# Altium schematic sheet PLL.SchDoc
size B; SheetNumber: 9; SheetTotal: 9
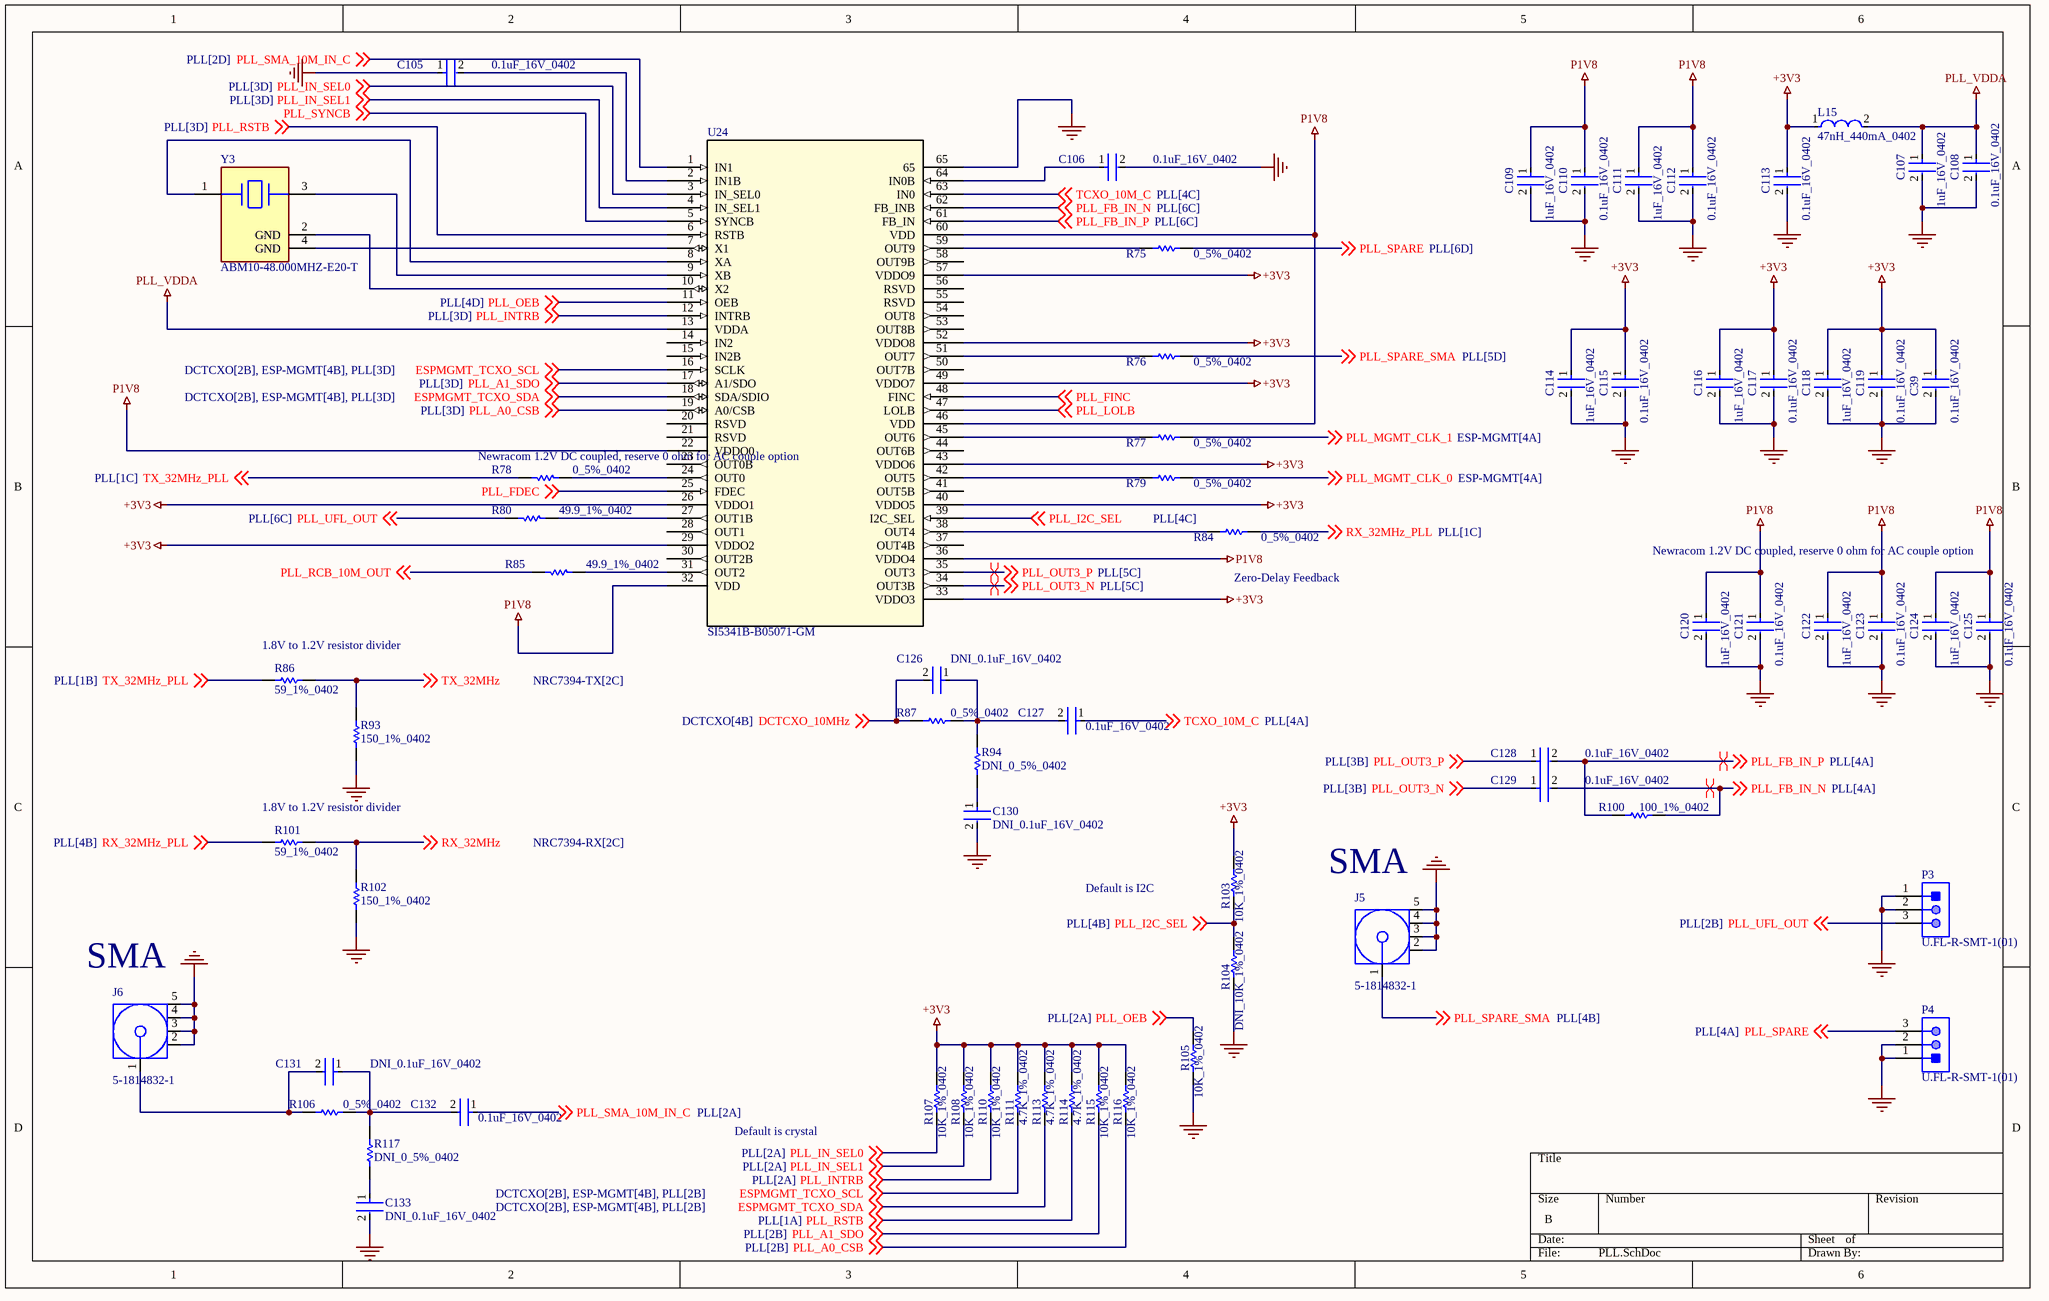
[diagram p0: PLL.SchDoc]

## Parts
C39  0.1uF_16V_0402  [FP-C0402-BB-MFG]
C105  0.1uF_16V_0402  [FP-C0402-BB-MFG]
C106  0.1uF_16V_0402  [FP-C0402-BB-MFG]
C107  1uF_16V_0402  [FP-0402-L_1_0_0_05-W_0_5-IPC_A]
C108  0.1uF_16V_0402  [FP-C0402-BB-MFG]
C109  1uF_16V_0402  [FP-0402-L_1_0_0_05-W_0_5-IPC_A]
C110  0.1uF_16V_0402  [FP-C0402-BB-MFG]
C111  1uF_16V_0402  [FP-0402-L_1_0_0_05-W_0_5-IPC_A]
C112  0.1uF_16V_0402  [FP-C0402-BB-MFG]
C113  0.1uF_16V_0402  [FP-C0402-BB-MFG]
C114  1uF_16V_0402  [FP-0402-L_1_0_0_05-W_0_5-IPC_A]
C115  0.1uF_16V_0402  [FP-C0402-BB-MFG]
C116  1uF_16V_0402  [FP-0402-L_1_0_0_05-W_0_5-IPC_A]
C117  0.1uF_16V_0402  [FP-C0402-BB-MFG]
C118  1uF_16V_0402  [FP-0402-L_1_0_0_05-W_0_5-IPC_A]
C119  0.1uF_16V_0402  [FP-C0402-BB-MFG]
C120  1uF_16V_0402  [FP-0402-L_1_0_0_05-W_0_5-IPC_A]
C121  0.1uF_16V_0402  [FP-C0402-BB-MFG]
C122  1uF_16V_0402  [FP-0402-L_1_0_0_05-W_0_5-IPC_A]
C123  0.1uF_16V_0402  [FP-C0402-BB-MFG]
C124  1uF_16V_0402  [FP-0402-L_1_0_0_05-W_0_5-IPC_A]
C125  0.1uF_16V_0402  [FP-C0402-BB-MFG]
C126  DNI_0.1uF_16V_0402  [FP-C0402-BB-MFG]  (no BOM)
C127  0.1uF_16V_0402  [FP-C0402-BB-MFG]
C128  0.1uF_16V_0402  [FP-C0402-BB-MFG]
C129  0.1uF_16V_0402  [FP-C0402-BB-MFG]
C130  DNI_0.1uF_16V_0402  [FP-C0402-BB-MFG]  (no BOM)
C131  DNI_0.1uF_16V_0402  [FP-C0402-BB-MFG]  (no BOM)
C132  0.1uF_16V_0402  [FP-C0402-BB-MFG]
C133  DNI_0.1uF_16V_0402  [FP-C0402-BB-MFG]  (no BOM)
J5  5-1814832-1  [TECO-5-1814832-1_V]
J6  5-1814832-1  [TECO-5-1814832-1_V]
L15  47nH_440mA_0402  [FP-LQW15AN_80-MFG]
P3  U.FL-R-SMT-1(01)  [HRS-U.FL-R-SMT-3_V]
P4  U.FL-R-SMT-1(01)  [HRS-U.FL-R-SMT-3_V]
R75  0_5%_0402  [RESC1005X40X25NL05T10]
R76  0_5%_0402  [RESC1005X40X25NL05T10]
R77  0_5%_0402  [RESC1005X40X25NL05T10]
R78  0_5%_0402  [RESC1005X40X25NL05T10]
R79  0_5%_0402  [RESC1005X40X25NL05T10]
R80  49.9_1%_0402  [RESC1005X40X25NL10T10]
R84  0_5%_0402  [RESC1005X40X25NL05T10]
R85  49.9_1%_0402  [RESC1005X40X25NL10T10]
R86  59_1%_0402  [RESC1005X40X25LL10T10]
R87  0_5%_0402  [RESC1005X40X25NL05T10]
R93  150_1%_0402  [RESC1005X40X25NL10T10]
R94  DNI_0_5%_0402  [RESC1005X40X25NL05T10]  (no BOM)
R100  100_1%_0402  [RESC1005X40X25NL05T10]
R101  59_1%_0402  [RESC1005X40X25LL10T10]
R102  150_1%_0402  [RESC1005X40X25NL10T10]
R103  10K_1%_0402  [RESC1005X40X25NL10T10]
R104  DNI_10K_1%_0402  [RESC1005X40X25NL10T10]  (no BOM)
R105  10K_1%_0402  [RESC1005X40X25NL10T10]
R106  0_5%_0402  [RESC1005X40X25NL05T10]
R107  10K_1%_0402  [RESC1005X40X25NL10T10]
R108  10K_1%_0402  [RESC1005X40X25NL10T10]
R110  10K_1%_0402  [RESC1005X40X25NL10T10]
R111  4.7K_1%_0402  [RESC1005X40X25NL10T10]
R113  4.7K_1%_0402  [RESC1005X40X25NL10T10]
R114  4.7K_1%_0402  [RESC1005X40X25NL10T10]
R115  10K_1%_0402  [RESC1005X40X25NL10T10]
R116  10K_1%_0402  [RESC1005X40X25NL10T10]
R117  DNI_0_5%_0402  [RESC1005X40X25NL05T10]  (no BOM)
U24  SI5341B-B05071-GM  [QFN64_SI5341_SIL_SKY]
Y3  ABM10-48.000MHZ-E20-T  [FP-ABM10-MFG]

## Nets
+3V3: C39.1 C113.1 C114.1 C115.1 C116.1 C117.1 C118.1 C119.1 L15.1 R103.2 R107.2 R108.2 R110.2 R111.2 R113.2 R114.2 R115.2 R116.2 U24.26(VDDO1) U24.29(VDDO2) U24.33(VDDO3) U24.40(VDDO5) U24.43(VDDO6) U24.49(VDDO7) U24.52(VDDO8) U24.57(VDDO9)
GND: C39.2 C105.1 C106.2 C107.2 C108.2 C109.2 C110.2 C111.2 C112.2 C113.2 C114.2 C115.2 C116.2 C117.2 C118.2 C119.2 C120.2 C121.2 C122.2 C123.2 C124.2 C125.2 C130.2 C133.2 J5.2 J5.3 J5.4 J5.5 J6.2 J6.3 J6.4 J6.5 P3.1 P3.2 P4.1 P4.2 R93.1 R102.1 R104.1 R105.1 U24.65
P1V8: C109.1 C110.1 C111.1 C112.1 C120.1 C121.1 C122.1 C123.1 C124.1 C125.1 U24.22(VDDO0) U24.32(VDD) U24.36(VDDO4) U24.46(VDD) U24.60(VDD)
PLL_VDDA: C107.1 C108.1 L15.2 U24.13(VDDA)
DCTCXO_10MHz: C126.2 R87.1 ; off-sheet DCTCXO_10MHz
ESPMGMT_TCXO_SCL: R111.1 U24.16(SCLK) ; off-sheet ESPMGMT_TCXO_SCL
ESPMGMT_TCXO_SDA: R113.1 U24.18(SDA/SDIO) ; off-sheet ESPMGMT_TCXO_SDA
PLL_A0_CSB: R116.1 U24.19(A0/CSB) ; off-sheet PLL_A0_CSB
PLL_A1_SDO: R115.1 U24.17(A1/SDO) ; off-sheet PLL_A1_SDO
PLL_FB_IN_N: C129.2 R100.2 U24.62(FB_INB) ; off-sheet PLL_FB_IN_N
PLL_FB_IN_P: C128.2 R100.1 U24.61(FB_IN) ; off-sheet PLL_FB_IN_P
PLL_FDEC: U24.25(FDEC) ; off-sheet PLL_FDEC
PLL_FINC: U24.48(FINC) ; off-sheet PLL_FINC
PLL_I2C_SEL: R103.1 R104.2 U24.39(I2C_SEL) ; off-sheet PLL_I2C_SEL
PLL_IN_SEL0: R107.1 U24.3(IN_SEL0) ; off-sheet PLL_IN_SEL0
PLL_IN_SEL1: R108.1 U24.4(IN_SEL1) ; off-sheet PLL_IN_SEL1
PLL_INTRB: R110.1 U24.12(INTRB) ; off-sheet PLL_INTRB
PLL_LOLB: U24.47(LOLB) ; off-sheet PLL_LOLB
PLL_MGMT_CLK_0: R79.2 ; off-sheet PLL_MGMT_CLK_0
PLL_MGMT_CLK_1: R77.2 ; off-sheet PLL_MGMT_CLK_1
PLL_OEB: R105.2 U24.11(OEB) ; off-sheet PLL_OEB
PLL_OUT3_N: C129.1 U24.34(OUT3B) ; off-sheet PLL_OUT3_N
PLL_OUT3_P: C128.1 U24.35(OUT3) ; off-sheet PLL_OUT3_P
PLL_RCB_10M_OUT: R85.1 ; off-sheet PLL_RCB_10M_OUT
PLL_RSTB: R114.1 U24.6(RSTB) ; off-sheet PLL_RSTB
PLL_SMA_10M_IN_C: C132.1 U24.1(IN1) ; off-sheet PLL_SMA_10M_IN_C
PLL_SPARE: P4.3 R75.2 ; off-sheet PLL_SPARE
PLL_SPARE_SMA: J5.1 R76.2 ; off-sheet PLL_SPARE_SMA
PLL_SYNCB: U24.5(SYNCB) ; off-sheet PLL_SYNCB
PLL_UFL_OUT: P3.3 R80.1 ; off-sheet PLL_UFL_OUT
RX_32MHz: R101.2 R102.2 ; off-sheet RX_32MHz
RX_32MHz_PLL: R84.2 R101.1 ; off-sheet RX_32MHz_PLL
TCXO_10M_C: C127.1 U24.63(IN0) ; off-sheet TCXO_10M_C
TX_32MHz: R86.2 R93.2 ; off-sheet TX_32MHz
TX_32MHz_PLL: R78.2 R86.1 ; off-sheet TX_32MHz_PLL
NetC105_2: C105.2 U24.2(IN1B)
NetC106_1: C106.1 U24.64(IN0B)
NetC126_1: C126.1 C127.2 R87.2 R94.2
NetC130_1: C130.1 R94.1
NetC131_1: C131.1 C132.2 R106.2 R117.2
NetC131_2: C131.2 J6.1 R106.1
NetC133_1: C133.1 R117.1
NetR75_1: R75.1 U24.59(OUT9)
NetR76_1: R76.1 U24.51(OUT7)
NetR77_1: R77.1 U24.45(OUT6)
NetR78_1: R78.1 U24.24(OUT0)
NetR79_1: R79.1 U24.42(OUT5)
NetR80_2: R80.2 U24.27(OUT1B)
NetR84_1: R84.1 U24.38(OUT4)
NetR85_2: R85.2 U24.31(OUT2)
NetU24_7: U24.7(X1) Y3.4(GND)
NetU24_8: U24.8(XA) Y3.1
NetU24_9: U24.9(XB) Y3.3
NetU24_10: U24.10(X2) Y3.2(GND)

Not connected (* = marked no-connect by the designer): U24 14(IN2) 15(IN2B) 20(RSVD) 21(RSVD) 23(OUT0B) 28(OUT1) 30(OUT2B) 37(OUT4B) 41(OUT5B) 44(OUT6B) 50(OUT7B) 53(OUT8B) 54(OUT8) 55(RSVD) 56(RSVD) 58(OUT9B)

## Layout directives
differential pair: PLL_FB_IN_N, PLL_FB_IN_P, PLL_OUT3_N, PLL_OUT3_P

## Notes on the sheet
- Newracom 1.2V DC coupled, reserve 0 ohm for AC couple option
- (near R84) Newracom 1.2V DC coupled, reserve 0 ohm for AC couple option
- (near R84) Zero-Delay Feedback
- (near R86) 1.8V to 1.2V resistor divider
- (near R101) 1.8V to 1.2V resistor divider
- Default is I2C
- (near J5) SMA
- (near J6) SMA
- Default is crystal

## Library data of the parts
C39 C105 C106 C108 C110 C112 C113 C115 C117 C119 C121 C123 C125-C133 = CMP-1034-02068-3: CAP CER 0.1UF 16V 5% X7R 0402; Manufacturer: Kemet; Manufacturer Part Number: C0402C104J4RACTU; Value: 0.10 μF; Temperature Coefficient: 15%; Tolerance: 0.05; Material: Ceramic; ComponentLink2URL: https://content.kemet.com/datasheets/KEM_C1002_X7R_SMD.pdf; Automotive: No; Device Class L2: Capacitors; Temperature: -55°C to +125°C; RoHS: TRUE; Voltage Rating: 16 V; ComponentLink2Description: Datasheet; Device Class L3: Ceramic Capacitors; Temperature Range Low: -55°C; Ipc Land Pattern Name: CAPC10050X50; Device Class L1: Passive Components; Temperature Range High: +125°C; Package: C0402-BB; Capacitance: 0.10 μF; Category: Cap; Mouser Description: CAP CER 0.1UF 16V X7R 0402; Height: 0.55mm; Digikey Description: CAP CER 0.1UF 16V 5% X7R 0402; Octopart: https://octopart.com/c0402c104j4ractu-kemet-12573893; Temperature Characteristic: X7R; Lead Free: Yes
C107 C109 C111 C114 C116 C118 C120 C122 C124 = CMP-14477-000104-2: None; Tolerance: 10%; Voltage Rating: 16V; Dielectric: X5R; Capacitance: 1uF; Packaging: Tape and Reel; Depth: 0.5mm; Mount: Surface Mount; Thickness: 0.022inch; Package Quantity: 1; Min Operating Temperature: -55°C; Series: M; Voltage Rating (DC): 16V; Termination: SMD/SMT; Case/Package: 0402; Number of Pins: 2; Case Code (Imperial): 0402; Length: 1mm; Halogen Free: Halogen Free; Case Code (Metric): 1005; Width: 0.02inch; RoHS Compliant: Yes; Radiation Hardening: No; Max Operating Temperature: 85°C; Height: 0.5mm; Construction: Flat
J5 J6 = CMP-2000-05415-1: SMA Connector, Pitch 5.08 mm, 1 Position, Height 9.5 mm, Tail Length 4 mm, -65 to 165 degC, RoHS, Bulk; Manufacturer: TE Connectivity; Connector Mounting: PCBMount; Connector Body Style: StraightJack; Impedance: 50ohm; Coaxial Termination: Solder; SVHC: NoSVHC(15-Jun-2015); Frequency Max: 3GHz; Product Range: ZDCSeries; Connector Type: SMACoaxial; Datasheet Version: Rev. B1, 03/2011; Package Reference: 5-1814832-1; Package Description: SMA Connector, Pitch 5.08 mm, 1 Position, Height 9.5 mm, Tail Length 4 mm; Contact Plating: GoldPlatedContacts; Coaxial Cable Types: -; Contact Material: BerylliumCopper; Manufacturer URL: http://www.te.com/; Datasheet URL: http://www.onlinecomponents.com/productFiles/mf-AMP/eng_cd_1814832_a.pdf
L15 = CMP-06042-005115-1: Wire Wound RF Inductor 47nH ±5% 440mA 0.648Ω 0402 (1005); Shielding: Unshielded; Core Material: Non-Magnetic; Test Frequency: 100MHz; Q Factor: 25; DC Resistance (DCR): 648mR; Self Resonant Frequency: 3.2GHz; Width: 0.024inch; Packaging: Tape and Reel; Mount: Surface Mount; Resistor Type: Wirewound; Termination: SMD/SMT; Tolerance: 5%; Case Code (Metric): 1005; Min Operating Temperature: -55°C; Current Rating: 440mA; Height: 0.5mm; Max Operating Temperature: 125°C; Case/Package: 0402; Height - Seated (Max): 0.024inch; Length: 0.039inch; Inductance: 47nH; Case Code (Imperial): 0402; Max DC Current: 440mA; Package Quantity: 1
P3 P4 = CMP-2000-05153-1: Ultra Small Coaxial Connector, 6 GHz, -40 to 90 degC, 3-Pin SMD, RoHS, Bulk; Manufacturer: Hirose Electric; Connector Style: U.FL; Impedance: 50Ohm; Dielectric Material: LiquidCrystalPolymer(LCP); Minimum Quantity: UltraMiniatureCoaxial; Online Catalog: U.FLSeries; Featured Product: HiroseU.FLSeries; Frequency - Max: 6GHz; Other Names: H122041 / U.FL-R-SMT-1(01)-ND; Contact Termination: Solder; Body Material: PhosphorBronze; Connector Type: Jack,MalePin; Body Finish: Silver; Center Contact Plating: Gold; Manufacturer URL: https://www.hirose.com; Family: CoaxialConnectors(RF); Fastening Type: Snap-On; Unit PriceUSD: U.FL; Series: U.FL; Package Reference: U.FL-R-SMT; Packaging: Bulk; Standard Package: 100; Mounting Type: SurfaceMount; Quantity Available: Bulk; Housing Color: Silver; Package Description: 3-Pin Surface Mount Device, Body 2.6 x 2.6 mm; Category: Connectors,Interconnects; Operating Temperature: -40degC~90degC; Center Contact Material: PhosphorBronze; Dynamic Catalog: U.FLSeries; Datasheet URL: https://datasheet.ciiva.com/26945/getdatasheetpartid-475239-26945414.pdf; Datasheet Version: Feb-09; Shield Termination: Solder
R75-R79 R84 R87 R94 R106 R117 = CMP-2002-06457-1: Manufacturer: Panasonic; Part Number: ERJ-U020R00X
R80 R85 = CMP-2002-04448-1: Part Number: RK73H1ETTP49R9F; Manufacturer: KOA Speer
R86 R101 = CMP-1011-00371-2: Part Number: CR0402-FX-59R0GLF; Manufacturer: Bourns
R93 R102 = CMP-2002-05949-1: Part Number: MC00625W04021150R; Manufacturer: Multicomp
R100 = CMP-2002-07853-1: Manufacturer: Yageo; Part Number: RC0402FR-13100RL
R103-R105 R107 R108 R110 R115 R116 = CMP-2002-04694-1: Manufacturer: Bourns; Part Number: CR0402-FX-1002GLF
R111 R113 R114 = CMP-2002-05217-1: Manufacturer: Bourns; Part Number: CR0402-FX-4701GLF
U24 = SI5341B-B05071-GM: No Description Available; Mfr_Name: Skyworks; Type: DEV; Copyright: Copyright (C) 2023 Ultra Librarian. All rights reserved.; Manufacturer_Part_Number: SI5341B-B05071-GM; RefDes: RefDes
Y3 = CMP-27762-011866-1: Crystal 48MHz ±20ppm 10pF SMD-4 2.5mm x 2mm; ESR (Equivalent Series Resistance): 70R; Frequency Tolerance: 20ppm; Depth: 2mm; Height: 0.02inch; RoHS Compliant: Yes; Lead Free: Lead Free; Case/Package: CSMD; Tolerance: 20ppm; Operating Frequency: 48 MHz; Load Capacitance: 10pF; Package Quantity: 1000; Mount: Surface Mount; Number of Pins: 4; Frequency: 48MHz; Length: 2.5mm; Series Resistance: 70R; Packaging: Tape and Reel; Min Operating Temperature: -20°C; Max Operating Temperature: 70°C; Termination: SMD/SMT; Width: 0.079inch; Frequency Stability: 20ppm; Series: ABM10